# EAGLE design lab4_yz87 (EAGLE 8.6.0)
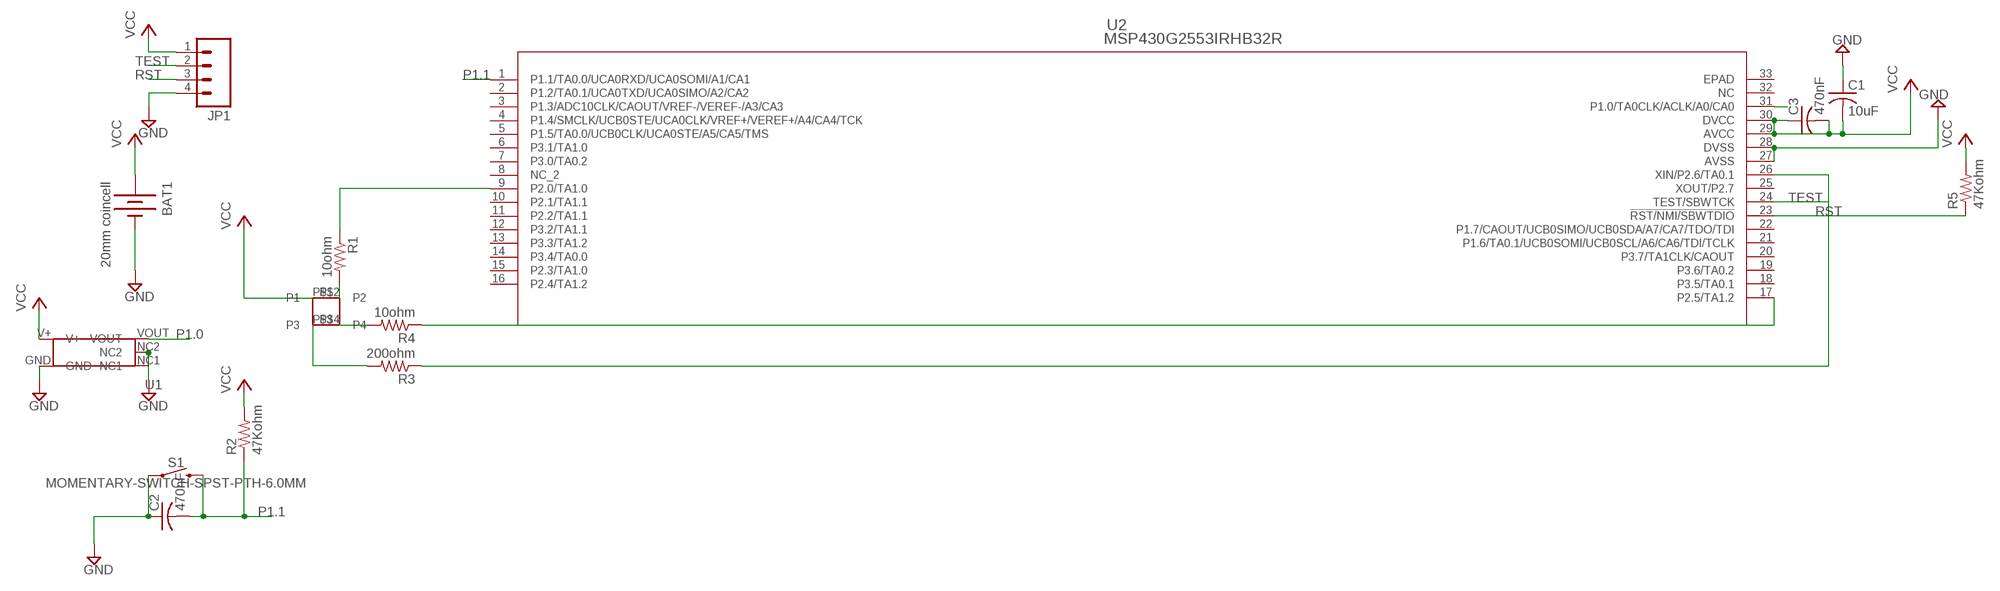
[diagram p0: schematic, sheet 1]

## Parts
BAT1  20mm coincell  BATTERYFOB  [BATTCON_20MM_PTH_COMPACT]
C1  10uF  C-USC1206  [C1206]
C2  470nF  C-USC1206  [C1206]
C3  470nF  C-USC1206  [C1206]
JP1  M04LOCK  [1X04_LOCK]
R1  10ohm  R-US_R1206  [R1206]
R2  47Kohm  R-US_R1206  [R1206]
R3  200ohm  R-US_R1206  [R1206]
R4  10ohm  R-US_R1206  [R1206]
R5  47Kohm  R-US_R1206  [R1206]
S1  MOMENTARY-SWITCH-SPST-PTH-6.0MM  [TACTILE_SWITCH_PTH_6.0MM]
U1  TEMPERATURE_SENSOR  [SOT_563]
U2  MSP430G2553IRHB32R  [RHB32_3P45X3P45]
U$2  RGB_LED  [1210RGB]

## Nets
GND: BAT1.2(-) C1.1 C2.1 JP1.4 S1.1 U1.GND U1.NC1 U1.NC2 U2.27(AVSS) U2.28(DVSS)
N$2: R4.2 U$2.P$4(P4)
N$3: R1.2 U$2.P$2(P2)
N$4: R3.2 U$2.P$3(P3)
N$5: R4.1 U2.17(P2.5/TA1.2)
N$6: R3.1 U2.26(XIN/P2.6/TA0.1)
N$7: R1.1 U2.9(P2.0/TA1.0)
P1.0: U1.VOUT U2.31(P1.0/TA0CLK/ACLK/A0/CA0)
P1.1: C2.2 R2.1 S1.3 U2.1(P1.1/TA0.0/UCA0RXD/UCA0SOMI/A1/CA1)
RST: JP1.3 R5.1 U2.23(!RST/NMI/SBWTDIO)
TEST: JP1.2 U2.24(TEST/SBWTCK)
VCC: BAT1.1(+) BAT1.3(+) BAT1.4(+) BAT1.5(+) C1.2 C3.1 C3.2 JP1.1 R2.2 R5.2 U1.V+ U2.29(AVCC) U2.30(DVCC) U$2.P$1(P1)
Unconnected: U2.2(P1.2/TA0.1/UCA0TXD/UCA0SIMO/A2/CA2) U2.3(P1.3/ADC10CLK/CAOUT/VREF-/VEREF-/A3/CA3) U2.4(P1.4/SMCLK/UCB0STE/UCA0CLK/VREF+/VEREF+/A4/CA4/TCK) U2.5(P1.5/TA0.0/UCB0CLK/UCA0STE/A5/CA5/TMS) U2.6(P3.1/TA1.0) U2.7(P3.0/TA0.2) U2.8(NC_2) U2.10(P2.1/TA1.1) U2.11(P2.2/TA1.1) U2.12(P3.2/TA1.1) U2.13(P3.3/TA1.2) U2.14(P3.4/TA0.0) U2.15(P2.3/TA1.0) U2.16(P2.4/TA1.2) U2.18(P3.5/TA0.1) U2.19(P3.6/TA0.2) U2.20(P3.7/TA1CLK/CAOUT) U2.21(P1.6/TA0.1/UCB0SOMI/UCB0SCL/A6/CA6/TDI/TCLK) U2.22(P1.7/CAOUT/UCB0SIMO/UCB0SDA/A7/CA7/TDO/TDI) U2.25(XOUT/P2.7) U2.32(NC) U2.33(EPAD)

## Library data of the parts
BAT1 = Battery:BATTERY: Compact CR2032 Battery Holder SMT ground pad 20MM_4LEGS, Digikey: BAT-HLD-001-THM-OTL
C1 = resistor:C-US: CAPACITOR, American symbol
C2 C3 = rcl:C-US: CAPACITOR, American symbol
JP1 = Pendant:M04: Header 4 Standard 4-pin 0.1" header. Use with straight break away headers (SKU : PRT-00116), right angle break away headers (PRT-00553), swiss pins (PRT-00743), machine pins (PRT-00117), and female headers (PRT-00115). Molex polarized connector foot print use with SKU : PRT-08231 with associated crimp pins and housings.
R1-R5 = resistor:R-US_: RESISTOR, American symbol
S1 = SparkFun-Switches:MOMENTARY-SWITCH-SPST: Momentary Switch (Pushbutton) - SPST Normally-open (NO) SPST momentary switches (buttons, pushbuttons). Variants PTH-12MM - 12mm square, through-hole Momentary Pushbutton Switch - 12mm Square <https://www.sparkfun.com/products/9190> (COM-09190) PTH-6.0MM, PTH-6.0MM-KIT - 6.0mm square, through-hole Mini Pushbutton Switch <https://www.sparkfun.com/products/97> (COM-00097) KIT package intended for soldering kit's - only one side of pads' copper is exposed. PTH-RIGHT-ANGLE-KIT - Right-angle, through-hole Right Angle Tactile Button <https://www.sparkfun.com/products/10791> - Used on SparkFun BigTime Watch Kit <https://www.sparkfun.com/products/11734> SMD-12MM - 12mm square, surface-mount Tactile Button - SMD (12mm) <https://www.sparkfun.com/products/12993> (COM-12993) Used on SparkFun PicoBoard <https://www.sparkfun.com/products/11888> SMD-4.5MM - 4.5mm Square Trackball Switch Used on SparkFun Blackberry Trackballer Breakout <https://www.sparkfun.com/products/13169> SMD-4.6MMX2.8MM - 4.60mm x 2.80mm, surface mount Used on SparkFun SAMD21 Mini Breakout <https://www.sparkfun.com/products/13664> SMD-5.2MM, SMD-5.2-REDUNDANT - 5.2mm square, surface-mount Mini Pushbutton Switch - SMD <https://www.sparkfun.com/products/8720> (COM-08720) Used on Arduino Pro Mini <https://www.sparkfun.com/products/11114> REDUNDANT package connects both switch circuits together SMD-6.0X3.5MM - 6.0 x 3.5mm, surface mount Momentary Reset Switch SMD <https://www.sparkfun.com/products/8229> (COM-08229) SMD-6.2MM-TALL - 6.2mm square, surface mount Tactile Button - SMD (6mm) <https://www.sparkfun.com/products/12992> Used on SparkFun Digital Sandbox <https://www.sparkfun.com/products/12651> SMD-RIGHT-ANGLE - Right-angle, surface mount Used on SparkFun Block for Intel® Edison - Arduino <https://www.sparkfun.com/products/13036>; PROD_ID: SWCH-08441; SF_SKU: COM-00097
U1 = ELEC327:TEMPERATURE_SENSOR
U2 = msp430qfn:MSP430G2553IRHB32R; MANUFACTURER_PART_NUMBER: MSP430G2553IRHB32R; VENDOR: Texas Instruments
U$2 = ELEC327:RGB_LED

## Board
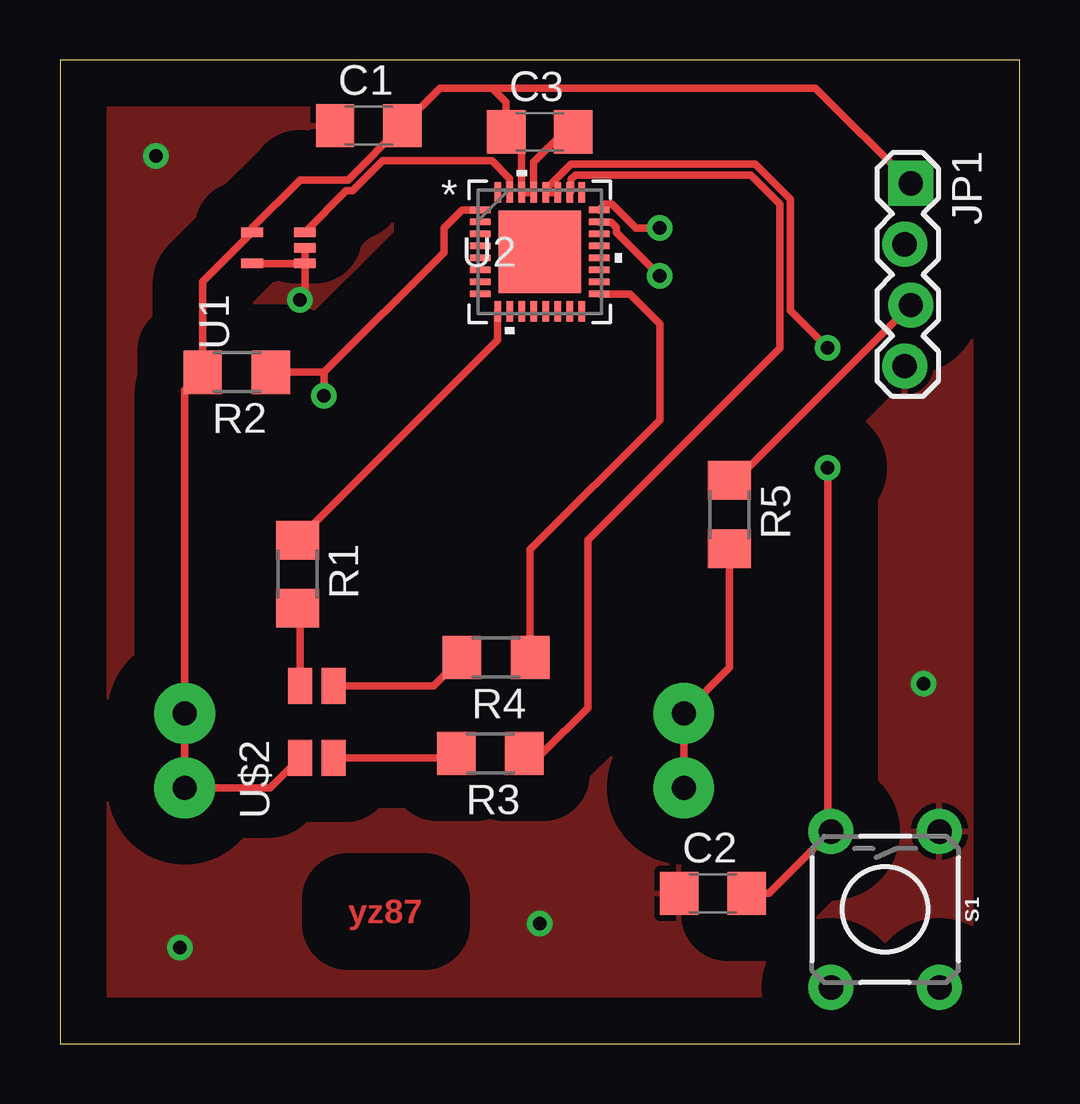
[diagram p1: board, top side]
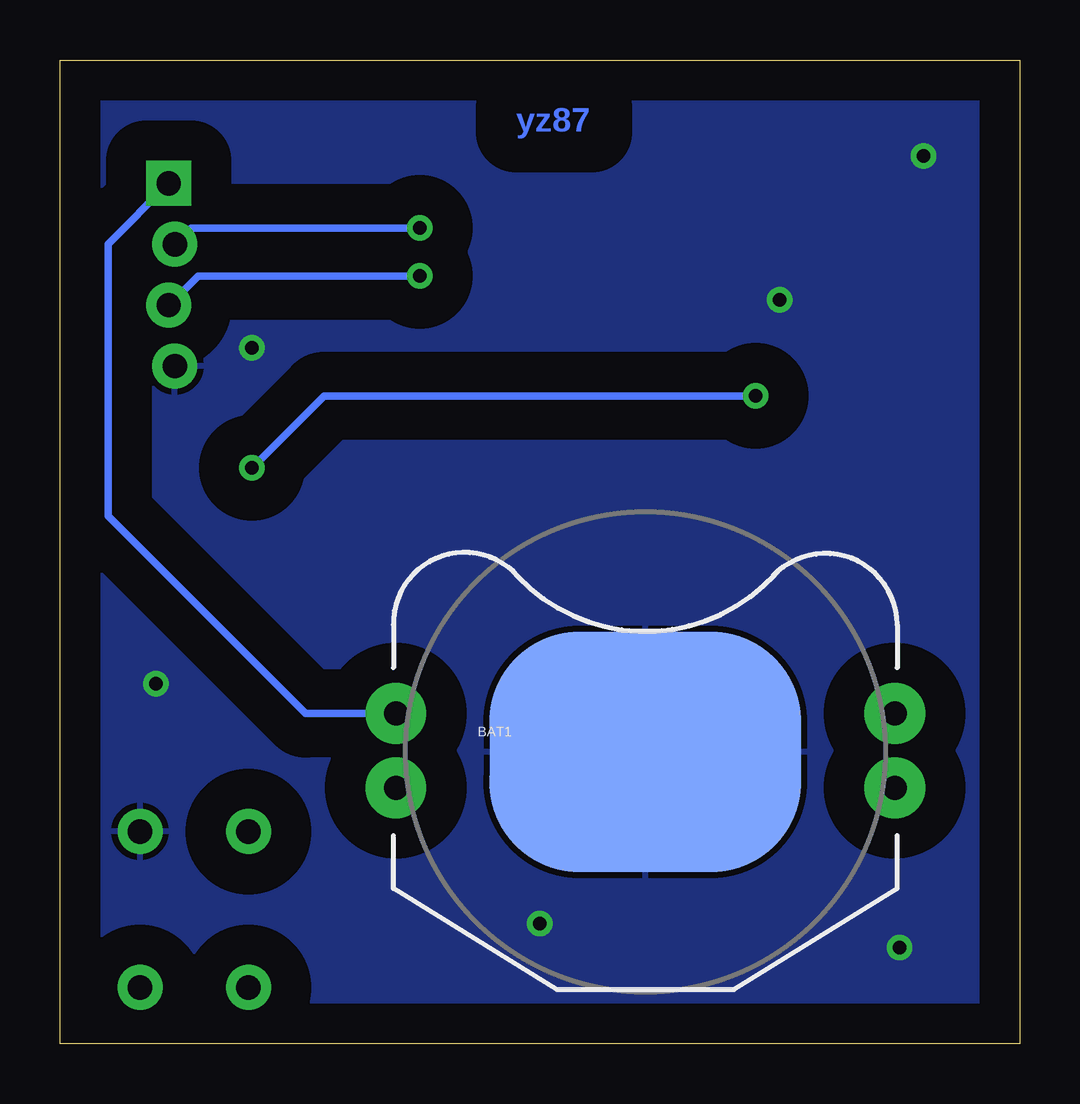
[diagram p2: board, bottom side, seen from below]

Size 40 x 41 mm. Coordinates in mm from the lower left corner, seen from the top.
Outline: 0,0 40,0 40,41 0,41 0,0
Copper layers (1*16): Top 0.035mm / dielectric 1.5mm / Bottom 0.035mm
Design rules "AdvancedCircuitsBarebones": minimum track width 6mil, minimum drill 20mil, track to track 6mil, track to pad 6mil, pad to pad 6mil, via to via 6mil, smd to smd 6mil, copper to edge 10mil, drill to drill 6mil, minimum pad ring 12mil, minimum via ring 10mil, stop-mask expansion 4mil, vias tented up to drill 25mil, thermal gap 10mil

### Footprints (pad centres in the part's own frame; a part is rotated, then mirrored left to right if it is on the bottom)
BATTCON_20MM_PTH_COMPACT = drill 1 pad 2.54: 1 -10.4,1.6; 3 10.4,1.6; 4 10.4,-1.5; 5 -10.4,-1.5 | smd 13 x 10: 2 0,0
C1206 = smd 1.6 x 1.8: 1 -1.4,0; 2 1.4,0
1X04_LOCK = drill 1.016 pad 1.88 square: 1 0,0.127 | drill 1.016 pad 1.88: 2 2.54,-0.127; 3 5.08,0.127; 4 7.62,-0.127
R1206 = smd 1.6 x 1.803: 1 -1.422,0; 2 1.422,0
TACTILE_SWITCH_PTH_6.0MM = drill 1.016 pad 1.88: 1 -3.251,2.261; 2 3.251,2.261; 3 -3.251,-2.261; 4 3.251,-2.261
SOT_563 = smd 0.4 x 0.9: GND 1,1; NC1 1,-1.2; NC2 1.65,-1.2; V+ 2.3,1; VOUT 2.3,-1.2
RHB32_3P45X3P45 = smd 0.85 x 0.28: 1 -2.475,1.75; 2 -2.475,1.25; 3 -2.475,0.75; 4 -2.475,0.25; 5 -2.475,-0.25; 6 -2.475,-0.75; 7 -2.475,-1.25; 8 -2.475,-1.75; 17 2.475,-1.75; 18 2.475,-1.25; 19 2.475,-0.75; 20 2.475,-0.25; 21 2.475,0.25; 22 2.475,0.75; 23 2.475,1.25; 24 2.475,1.75 | smd 0.28 x 0.85: 9 -1.75,-2.475; 10 -1.25,-2.475; 11 -0.75,-2.475; 12 -0.25,-2.475; 13 0.25,-2.475; 14 0.75,-2.475; 15 1.25,-2.475; 16 1.75,-2.475; 25 1.75,2.475; 26 1.25,2.475; 27 0.75,2.475; 28 0.25,2.475; 29 -0.25,2.475; 30 -0.75,2.475; 31 -1.25,2.475; 32 -1.75,2.475 | smd 3.45 x 3.45: 33 0,0
1210RGB = smd 1.5 x 1: P$1 0,0; P$2 3,0; P$3 0,-1.4; P$4 3,-1.4

### Placement (x,y rotation side)
BAT1  15.6,12.16 0 bottom
C1  12.87,38.26 0 top
C2  27.22,6.26 0 top
C3  20,38 0 top
JP1  35.34,35.86 270 top
R1  9.91,19.56 270 top
R2  7.37,27.98 180 top
R3  17.94,12.09 180 top
R4  18.18,16.09 180 top
R5  27.91,22.05 270 top
S1  34.4,5.59 270 top
U1  9.01,31.52 90 top
U2  20,33 0 top
U$2  10.01,11.9 90 top

### Tracks (layer width: path | path; a pad name or v marks a point on that pad's centre or on a via)
GND  (via drill 0.55, 0.55 pad 0.55)
  Top 0.305: U1.GND U1.NC1 | U1.NC1 U1.NC2 | U1.NC1 10.21,31.21 v10,31 | U2.27 U2.28 20.25,35.62 20.79,36.16 20.82,36.18 21.3,36.66 28.98,36.66 30.46,35.19 30.46,30.54 v32,29
  other vias: 4,37 5,4 20,5 36,15
  pour Top (isolate 1.93): 0,0 0,41 40,41 40,0
  pour Bottom (isolate 1.676): 0,0 0,41 40,41 40,0
N$2
  Top 0.305: U$2.P$4 15.57,14.9 R4.2
N$3
  Top 0.305: U$2.P$2 10.01,18.04 R1.2
N$4
  Top 0.305: U$2.P$3 16.33,11.9 R3.2
N$5
  Top 0.305: R4.1 19.6,20.6 25,26 25,29 25,29.31 25,30 23.75,31.25 U2.17
N$6
  Top 0.305: R3.1 20.09,12.09 22,14 22,21 30,29 30,34 30,35 28.8,36.2 21.48,36.2 21.31,36.03 21.31,35.53 U2.26
N$7
  Top 0.305: R1.1 18.25,29.32 U2.9
P1.0
  Top 0.305: U1.VOUT 11.93,35.54 12.2,35.54 13.45,36.8 18,36.8 18.75,36.05 U2.31
P1.1  (via drill 0.55)
  Top 0.305: R2.1 11,27.98 | 11,27.98 v11,27 | v32,24 32,8.98 S1.3 29.56,6.26 C2.2 | 11,27.98 16,32.98 16,34 16.75,34.75 U2.1
  Bottom 0.305: v11,27 29,27 v32,24
RST  (via drill 0.55)
  Top 0.305: 24.46,32.53 v25,32 23.2,33.8 23.2,34.02 22.97,34.25 U2.23 | R5.1 28.16,23.47 JP1.3
  Bottom 0.305: v25,32 34.25,32 JP1.3
TEST  (via drill 0.55)
  Top 0.305: v25,34 24,34 23,35 22.73,35 U2.24
  Bottom 0.305: v25,34 34.53,34 JP1.2
VCC
  Top 0.305: JP1.1 31.5,39.83 18,39.83 | BAT1.5 BAT1.1 27.91,15.67 R5.2 | U$2.P$1 8.77,10.66 BAT1.4 BAT1.3 5.2,27.23 R2.2 5.95,31.76 U1.V+ 8.01,34.01 10,36 12.01,36 C1.2 15.84,39.83 18,39.83 | 18,39.83 18.6,39.23 C3.1 19.25,37.35 U2.30 U2.29 19.75,36.75 21,38 C3.2
  Bottom 0.305: BAT1.1 29.76,13.76 38,22 38,33.33 JP1.1

### Text on the board
Top: yz87
Bottom: yz87